# EAGLE design MP9361 (EAGLE 9.0.0)
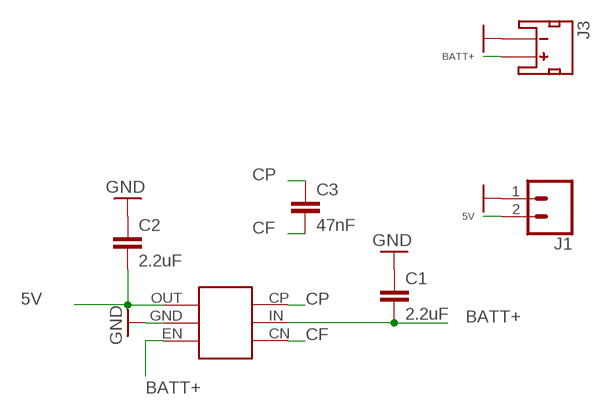
[diagram p0: schematic, sheet 1]

## Parts
C1  2.2uF  2.2UF-0805-25V-(+80/-20%)  [0805]
C2  2.2uF  2.2UF-0805-25V-(+80/-20%)  [0805]
C3  47nF  47NF-0603-25V-5%  [0603]
J1  CONN_02PTH4  [1X02_XTRA_BIG]
J3  Batt Conn  JST_2MM_MALE  [JST-2-SMD]
U1  MP9361  [MP9361]

## Nets
5V: C2.2 J1.2 U1.OUT
BATT+: C1.2 J3.2(+) U1.EN U1.IN
CF: C3.2 U1.CN
CP: C3.1 U1.CP
GND: C1.1 C2.1 J1.1 J3.1(-) U1.GND
Unconnected: J3.NC1(PAD1) J3.NC2(PAD2)

## Library data of the parts
C1 C2 = SparkFun-Capacitors:2.2UF: 2.2µF ceramic capacitors A capacitor is a passive two-terminal electrical component used to store electrical energy temporarily in an electric field.; PROD_ID: CAP-11624
C3 = SparkFun-Capacitors:47NF: 47nF ceramic capacitors A capacitor is a passive two-terminal electrical component used to store electrical energy temporarily in an electric field.; PROD_ID: CAP-08605
J1 = SparkFun-Connectors:CONN_02: Multi connection point. Often used as Generic Header-pin footprint for 0.1 inch spaced/style header connections On any of the 0.1 inch spaced packages, you can populate with these: Break Away Headers - Straight <https://www.sparkfun.com/products/116> (PRT-00116) Break Away Male Headers - Right Angle <https://www.sparkfun.com/products/553> (PRT-00553) Female Headers <https://www.sparkfun.com/products/115> (PRT-00115) Break Away Headers - Machine Pin <https://www.sparkfun.com/products/117> (PRT-00117) Break Away Female Headers - Swiss Machine Pin <https://www.sparkfun.com/products/743> (PRT-00743) For SCREWTERMINALS and SPRING TERMINALS visit here: Screw Terimnals on SparkFun.com <https://www.sparkfun.com/search/results?term=Screw+Terminals> (5mm/3.5mm/2.54mm spacing) This device is also useful as a general connection point to wire up your design to another part of your project. Our various solder wires solder well into these plated through hole pads. Hook-Up Wire - Assortment (Stranded, 22 AWG) <https://www.sparkfun.com/products/11375> (PRT-11375) Hook-Up Wire - Assortment (Solid Core, 22 AWG) <https://www.sparkfun.com/products/11367> (PRT-11367) View the entire wire category on our website here <https://www.sparkfun.com/categories/141> Special notes: Molex polarized connector foot print use with: PRT-08233 with associated crimp pins and housings. 2.54_SCREWTERM for use with PRT-10571. 3.5mm Screw Terminal footprints for PRT-08084 5mm Screw Terminal footprints for use with PRT-08432
J3 = SparkFun-Connectors:JST_2MM_MALE: Mates to single-cell LiPo batteries. CONN-11443 Now with smashable polarity marks!; BTM_NEG: -; BTM_POS: +; PROD_ID: CONN-11443; TOP_NEG: -; TOP_POS: +
U1 = 32teeth - MP9361:MP9361

## Board
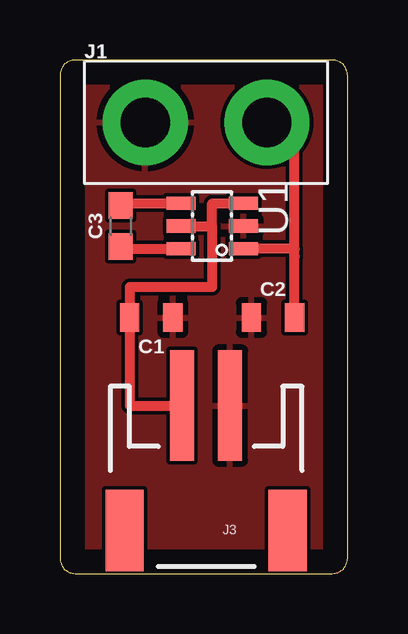
[diagram p1: board, top side]
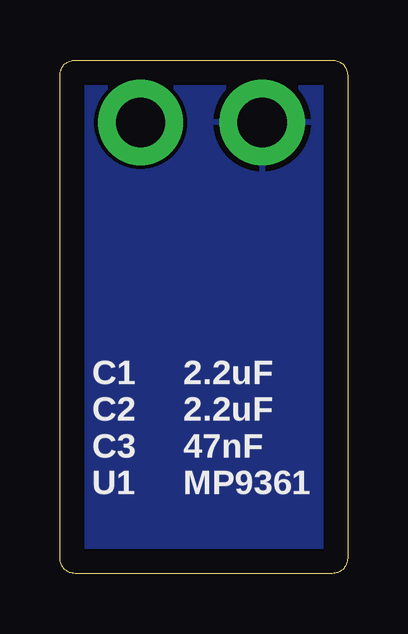
[diagram p2: board, bottom side, seen from below]

Size 12 x 21.4 mm. Coordinates in mm from the lower left corner, seen from the top.
Outline: 0,20.76 0,0.64 arc90 0.64,0 11.37,0 arc90 12,0.64 12,20.76 arc90 11.37,21.4 0.64,21.4 arc90 0,20.76
Copper layers (1*16): Top 0.035mm / dielectric 1.5mm / Bottom 0.035mm
Design rules "default": minimum track width 6mil, minimum drill 0.35mm, track to track 6mil, track to pad 6mil, pad to pad 6mil, via to via 6mil, smd to smd 6mil, copper to edge 40mil, drill to drill 6mil, minimum pad ring 10mil, minimum via ring 8mil, stop-mask expansion 4mil, vias tented up to drill 0mil, thermal gap 10mil

### Footprints (pad centres in the part's own frame; a part is rotated, then mirrored left to right if it is on the bottom)
0805 = smd 0.8 x 1.2: 1 -0.9,0; 2 0.9,0
0603 = smd 1.1 x 1: 1 -0.85,0; 2 0.85,0
1X02_XTRA_BIG = drill 2.057 pad 3.556: 1 -2.54,0; 2 2.54,0
JST-2-SMD = smd 1 x 4.6: 1 -1,-3.7; 2 1,-3.7 | smd 1.6 x 3.4: NC1 -3.4,1.5; NC2 3.4,1.5
MP9361 = smd 0.55 x 1.2: CN 0.95,1.3; CP -0.95,1.3; EN 0.95,-1.3; GND 0,-1.3; IN 0,1.3; OUT -0.95,-1.3

### Placement (x,y rotation side)
C1  3.81,10.67 180 top
C2  8.89,10.67 0 top
C3  2.54,14.48 90 top
J1  6.1,18.8 0 top
J3  6.1,3.3 180 top
U1  6.35,14.48 90 top

### Tracks (layer width: path | path; a pad name or v marks a point on that pad's centre or on a via)
5V
  Top 0.406: C2.2 9.79,13.21 | 9.79,13.21 9.79,13.53 U1.OUT | 9.79,13.21 9.79,18.8 J1.2
BATT+
  Top 0.406: U1.IN 6.35,14.48 | 6.35,14.48 6.35,15.43 U1.EN | 6.35,14.48 6.35,11.94 2.91,11.94 C1.2 2.91,7 J3.2
CF
  Top 0.406: C3.2 2.54,15.43 U1.CN
CP
  Top 0.406: C3.1 2.54,13.53 U1.CP
GND
  pour Bottom: 0,21.4 12,21.4 12,0 0,0
  pour Top: 0,21.4 12,21.4 12,0 0,0

### Text on the board
bNames: C1 2.2uF / C2 2.2uF / C3 47nF / U1 MP9361